# Altium schematic sheet EPS_MPPT_Y_EMI-Filter_Solar-Panels.SchDoc: MPPTY EMI Filters for Solar Panels
size A4; Date: 2015-02-21; Author: Piotr Kuligowski; Revision: 1-0; SheetNumber: 18; SheetTotal: 51; Model: EM1
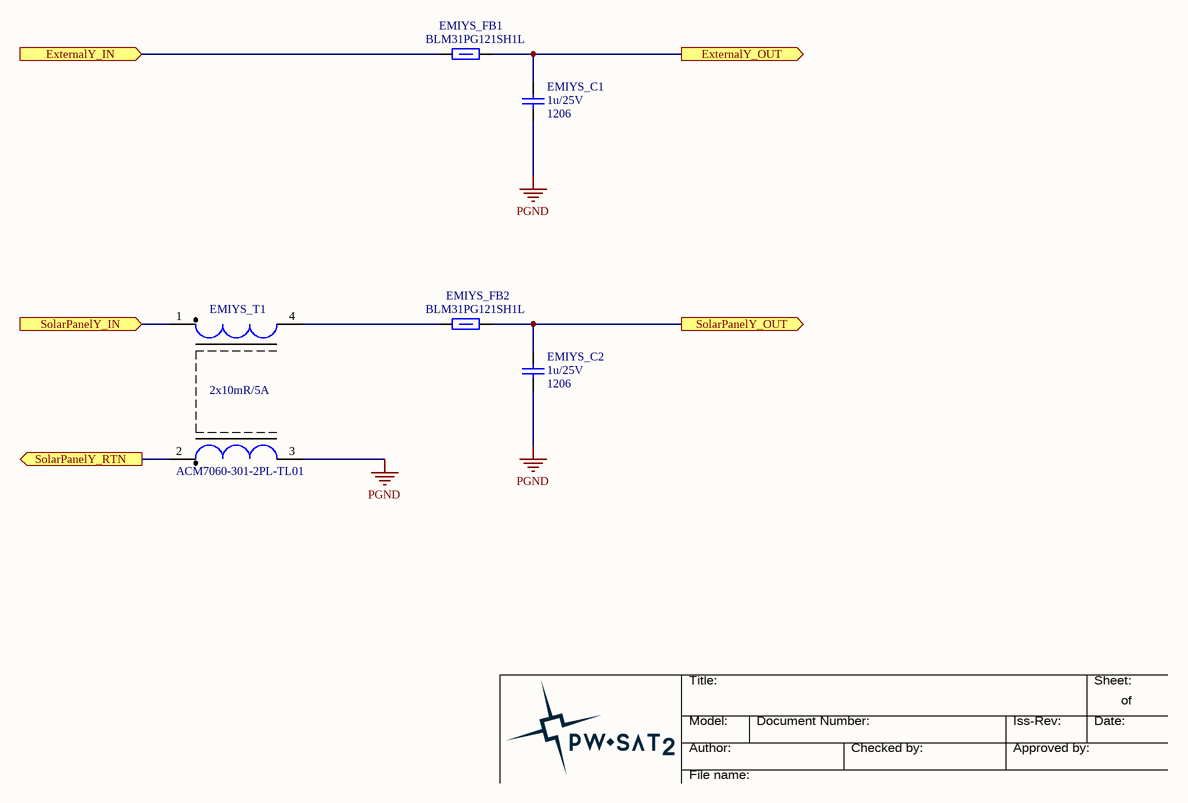
[diagram p0: EPS_MPPT_Y_EMI-Filter_Solar-Panels.SchDoc]

## Parts
EMIYS_C1  Package: 1206  [SMD_Capacitor_1206]  (hidden comment: 1u/25V)
EMIYS_C2  Package: 1206  [SMD_Capacitor_1206]  (hidden comment: 1u/25V)
EMIYS_FB1  120R/100MHz  [SMD_FerriteBead_1206]  (value not drawn)
EMIYS_FB2  120R/100MHz  [SMD_FerriteBead_1206]  (value not drawn)
EMIYS_T1  2x10mR/5A  [TDK_ACM7060]

## Ports
ExternalY_IN (in), ExternalY_OUT (out), SolarPanelY_IN (in), SolarPanelY_OUT (out), SolarPanelY_RTN (out)

## Nets
PGND: EMIYS_C1.2 EMIYS_C2.2 EMIYS_T1.3
ExternalY_IN: EMIYS_FB1.2 ; port ExternalY_IN
ExternalY_OUT: EMIYS_C1.1 EMIYS_FB1.1 ; port ExternalY_OUT
SolarPanelY_IN: EMIYS_T1.1 ; port SolarPanelY_IN
SolarPanelY_OUT: EMIYS_C2.1 EMIYS_FB2.1 ; port SolarPanelY_OUT
SolarPanelY_RTN: EMIYS_T1.2 ; port SolarPanelY_RTN
NetEMIYS_FB2_2: EMIYS_FB2.2 EMIYS_T1.4

## Notes on the sheet
- Title:
- Sheet:
- of
- Author:
- Model:
- Document Number:
- Checked by:
- Iss-Rev:
- Approved by:
- Date:
- File name:

## Library data of the parts
EMIYS_C1 EMIYS_C2 = Cer_C1206T105K3RALTU: Ceramic Cap Kemet COTS 1u/25V X7R 1206; ManufacturerPartNumber: C1206T105K3RALTU; Manufacturer: Kemet; Value: 1u/25V
EMIYS_FB1 EMIYS_FB2 = BLM31PG121SH1L: Ferrite bead, 1206, 0.02HM, 3.5A.; Manufacturer: Murata; Current Rating: 3.5A; Series Resistance DC: 0.02R; Package: 1206; Value: 120R/100MHz; ManufacturerPartNumber: BLM31PG121SH1L
EMIYS_T1 = ACM7060-301-2PL-TL01: TDK ACM7060-301 Common Mode Choke; Manufacturer: TDK; ManufacturerPartNumber: ACM7060-301-2PL-TL01; Value: 2x10mR/5A